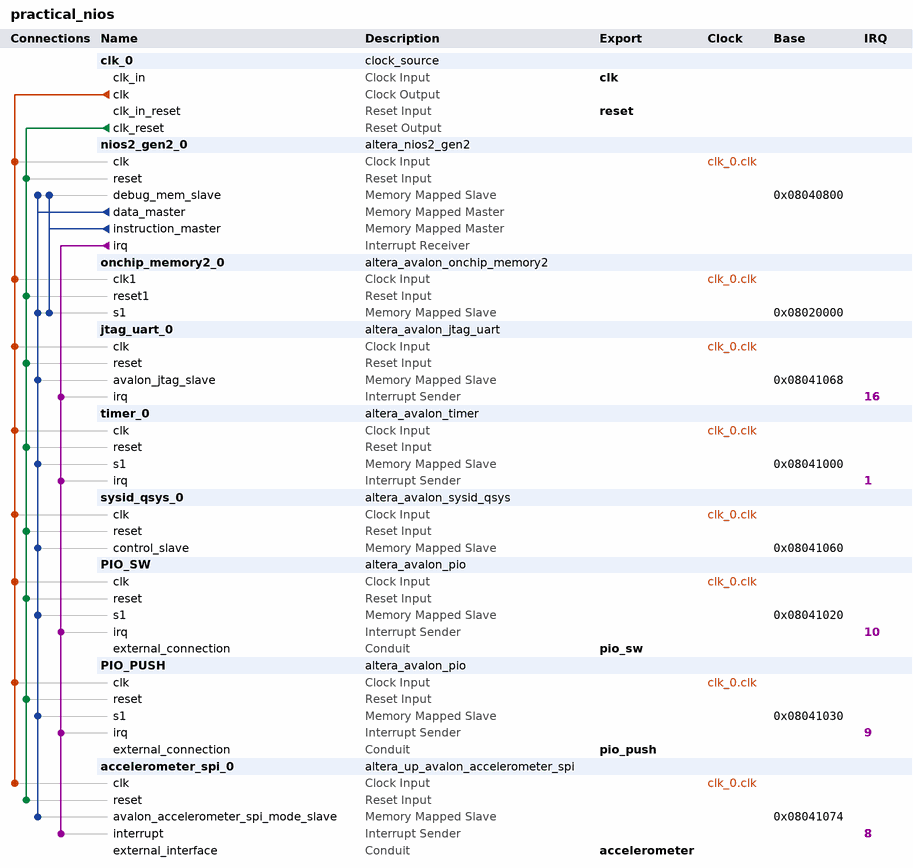
[diagram p0: system contents]
# Platform Designer (Qsys) system practical_nios, MAX 10 10M50DAF484C7G
# Parameters at their usual value, and those the tool derives, are not listed.
package require -exact qsys 18.0
create_system practical_nios
set_project_property DEVICE_FAMILY {MAX 10}
set_project_property DEVICE 10M50DAF484C7G

add_instance clk_0 clock_source 18.0
set_instance_parameter_value clk_0 clockFrequency 50000000

add_instance nios2_gen2_0 altera_nios2_gen2 18.0
set_instance_parameter_value nios2_gen2_0 dcache_size 2048
set_instance_parameter_value nios2_gen2_0 exceptionSlave onchip_memory2_0.s1
set_instance_parameter_value nios2_gen2_0 icache_size 4096
set_instance_parameter_value nios2_gen2_0 impl Fast
set_instance_parameter_value nios2_gen2_0 resetSlave onchip_memory2_0.s1

add_instance onchip_memory2_0 altera_avalon_onchip_memory2 18.0
set_instance_parameter_value onchip_memory2_0 dataWidth 32
set_instance_parameter_value onchip_memory2_0 dualPort false
set_instance_parameter_value onchip_memory2_0 initMemContent true
set_instance_parameter_value onchip_memory2_0 initializationFileName onchip_mem.hex
set_instance_parameter_value onchip_memory2_0 memorySize 100000

add_instance jtag_uart_0 altera_avalon_jtag_uart 18.0
set_instance_parameter_value jtag_uart_0 simInteractiveOptions NO_INTERACTIVE_WINDOWS

add_instance timer_0 altera_avalon_timer 18.0
set_instance_parameter_value timer_0 period 1
set_instance_parameter_value timer_0 periodUnits MSEC

add_instance sysid_qsys_0 altera_avalon_sysid_qsys 18.0
set_instance_parameter_value sysid_qsys_0 id 0

add_instance PIO_SW altera_avalon_pio 18.0
set_instance_parameter_value PIO_SW captureEdge true
set_instance_parameter_value PIO_SW direction Input
set_instance_parameter_value PIO_SW generateIRQ true
set_instance_parameter_value PIO_SW irqType EDGE
set_instance_parameter_value PIO_SW width 10

add_instance PIO_PUSH altera_avalon_pio 18.0
set_instance_parameter_value PIO_PUSH captureEdge true
set_instance_parameter_value PIO_PUSH direction Input
set_instance_parameter_value PIO_PUSH edgeType FALLING
set_instance_parameter_value PIO_PUSH generateIRQ true
set_instance_parameter_value PIO_PUSH irqType EDGE
set_instance_parameter_value PIO_PUSH width 4

add_instance accelerometer_spi_0 altera_up_avalon_accelerometer_spi 18.0

# connections
add_connection clk_0.clk accelerometer_spi_0.clk clock
add_connection clk_0.clk jtag_uart_0.clk clock
add_connection clk_0.clk nios2_gen2_0.clk clock
add_connection clk_0.clk onchip_memory2_0.clk1 clock
add_connection clk_0.clk PIO_PUSH.clk clock
add_connection clk_0.clk PIO_SW.clk clock
add_connection clk_0.clk sysid_qsys_0.clk clock
add_connection clk_0.clk timer_0.clk clock
add_connection clk_0.clk_reset accelerometer_spi_0.reset reset
add_connection clk_0.clk_reset jtag_uart_0.reset reset
add_connection clk_0.clk_reset nios2_gen2_0.reset reset
add_connection clk_0.clk_reset onchip_memory2_0.reset1 reset
add_connection clk_0.clk_reset PIO_PUSH.reset reset
add_connection clk_0.clk_reset PIO_SW.reset reset
add_connection clk_0.clk_reset sysid_qsys_0.reset reset
add_connection clk_0.clk_reset timer_0.reset reset
add_connection nios2_gen2_0.data_master accelerometer_spi_0.avalon_accelerometer_spi_mode_slave avalon
set_connection_parameter_value nios2_gen2_0.data_master/accelerometer_spi_0.avalon_accelerometer_spi_mode_slave baseAddress 0x08041074
add_connection nios2_gen2_0.data_master jtag_uart_0.avalon_jtag_slave avalon
set_connection_parameter_value nios2_gen2_0.data_master/jtag_uart_0.avalon_jtag_slave baseAddress 0x08041068
add_connection nios2_gen2_0.data_master nios2_gen2_0.debug_mem_slave avalon
set_connection_parameter_value nios2_gen2_0.data_master/nios2_gen2_0.debug_mem_slave baseAddress 0x08040800
add_connection nios2_gen2_0.data_master onchip_memory2_0.s1 avalon
set_connection_parameter_value nios2_gen2_0.data_master/onchip_memory2_0.s1 baseAddress 0x08020000
add_connection nios2_gen2_0.data_master PIO_PUSH.s1 avalon
set_connection_parameter_value nios2_gen2_0.data_master/PIO_PUSH.s1 baseAddress 0x08041030
add_connection nios2_gen2_0.data_master PIO_SW.s1 avalon
set_connection_parameter_value nios2_gen2_0.data_master/PIO_SW.s1 baseAddress 0x08041020
add_connection nios2_gen2_0.data_master sysid_qsys_0.control_slave avalon
set_connection_parameter_value nios2_gen2_0.data_master/sysid_qsys_0.control_slave baseAddress 0x08041060
add_connection nios2_gen2_0.data_master timer_0.s1 avalon
set_connection_parameter_value nios2_gen2_0.data_master/timer_0.s1 baseAddress 0x08041000
add_connection nios2_gen2_0.instruction_master nios2_gen2_0.debug_mem_slave avalon
set_connection_parameter_value nios2_gen2_0.instruction_master/nios2_gen2_0.debug_mem_slave baseAddress 0x08040800
add_connection nios2_gen2_0.instruction_master onchip_memory2_0.s1 avalon
set_connection_parameter_value nios2_gen2_0.instruction_master/onchip_memory2_0.s1 baseAddress 0x08020000
add_connection nios2_gen2_0.irq accelerometer_spi_0.interrupt interrupt
set_connection_parameter_value nios2_gen2_0.irq/accelerometer_spi_0.interrupt irqNumber 8
add_connection nios2_gen2_0.irq jtag_uart_0.irq interrupt
set_connection_parameter_value nios2_gen2_0.irq/jtag_uart_0.irq irqNumber 16
add_connection nios2_gen2_0.irq PIO_PUSH.irq interrupt
set_connection_parameter_value nios2_gen2_0.irq/PIO_PUSH.irq irqNumber 9
add_connection nios2_gen2_0.irq PIO_SW.irq interrupt
set_connection_parameter_value nios2_gen2_0.irq/PIO_SW.irq irqNumber 10
add_connection nios2_gen2_0.irq timer_0.irq interrupt
set_connection_parameter_value nios2_gen2_0.irq/timer_0.irq irqNumber 1

# exported interfaces
add_interface accelerometer conduit end
set_interface_property accelerometer EXPORT_OF accelerometer_spi_0.external_interface
add_interface clk clock sink
set_interface_property clk EXPORT_OF clk_0.clk_in
add_interface pio_push conduit end
set_interface_property pio_push EXPORT_OF PIO_PUSH.external_connection
add_interface pio_sw conduit end
set_interface_property pio_sw EXPORT_OF PIO_SW.external_connection
add_interface reset reset sink
set_interface_property reset EXPORT_OF clk_0.clk_in_reset

set_interconnect_requirement {$system} qsys_mm.clockCrossingAdapter HANDSHAKE
set_interconnect_requirement {$system} qsys_mm.enableEccProtection FALSE
set_interconnect_requirement {$system} qsys_mm.insertDefaultSlave FALSE
set_interconnect_requirement {$system} qsys_mm.maxAdditionalLatency 1

save_system practical_nios.qsys
